# EasyEDA schematic SCH_HomeAuto_2022-10-05.json
TITLE: Home Automation; REV: 1.0; Date: 2022-10-02; Sheet: 1/1; Drawn By: Gopal Naik; Company: Ajju Creation
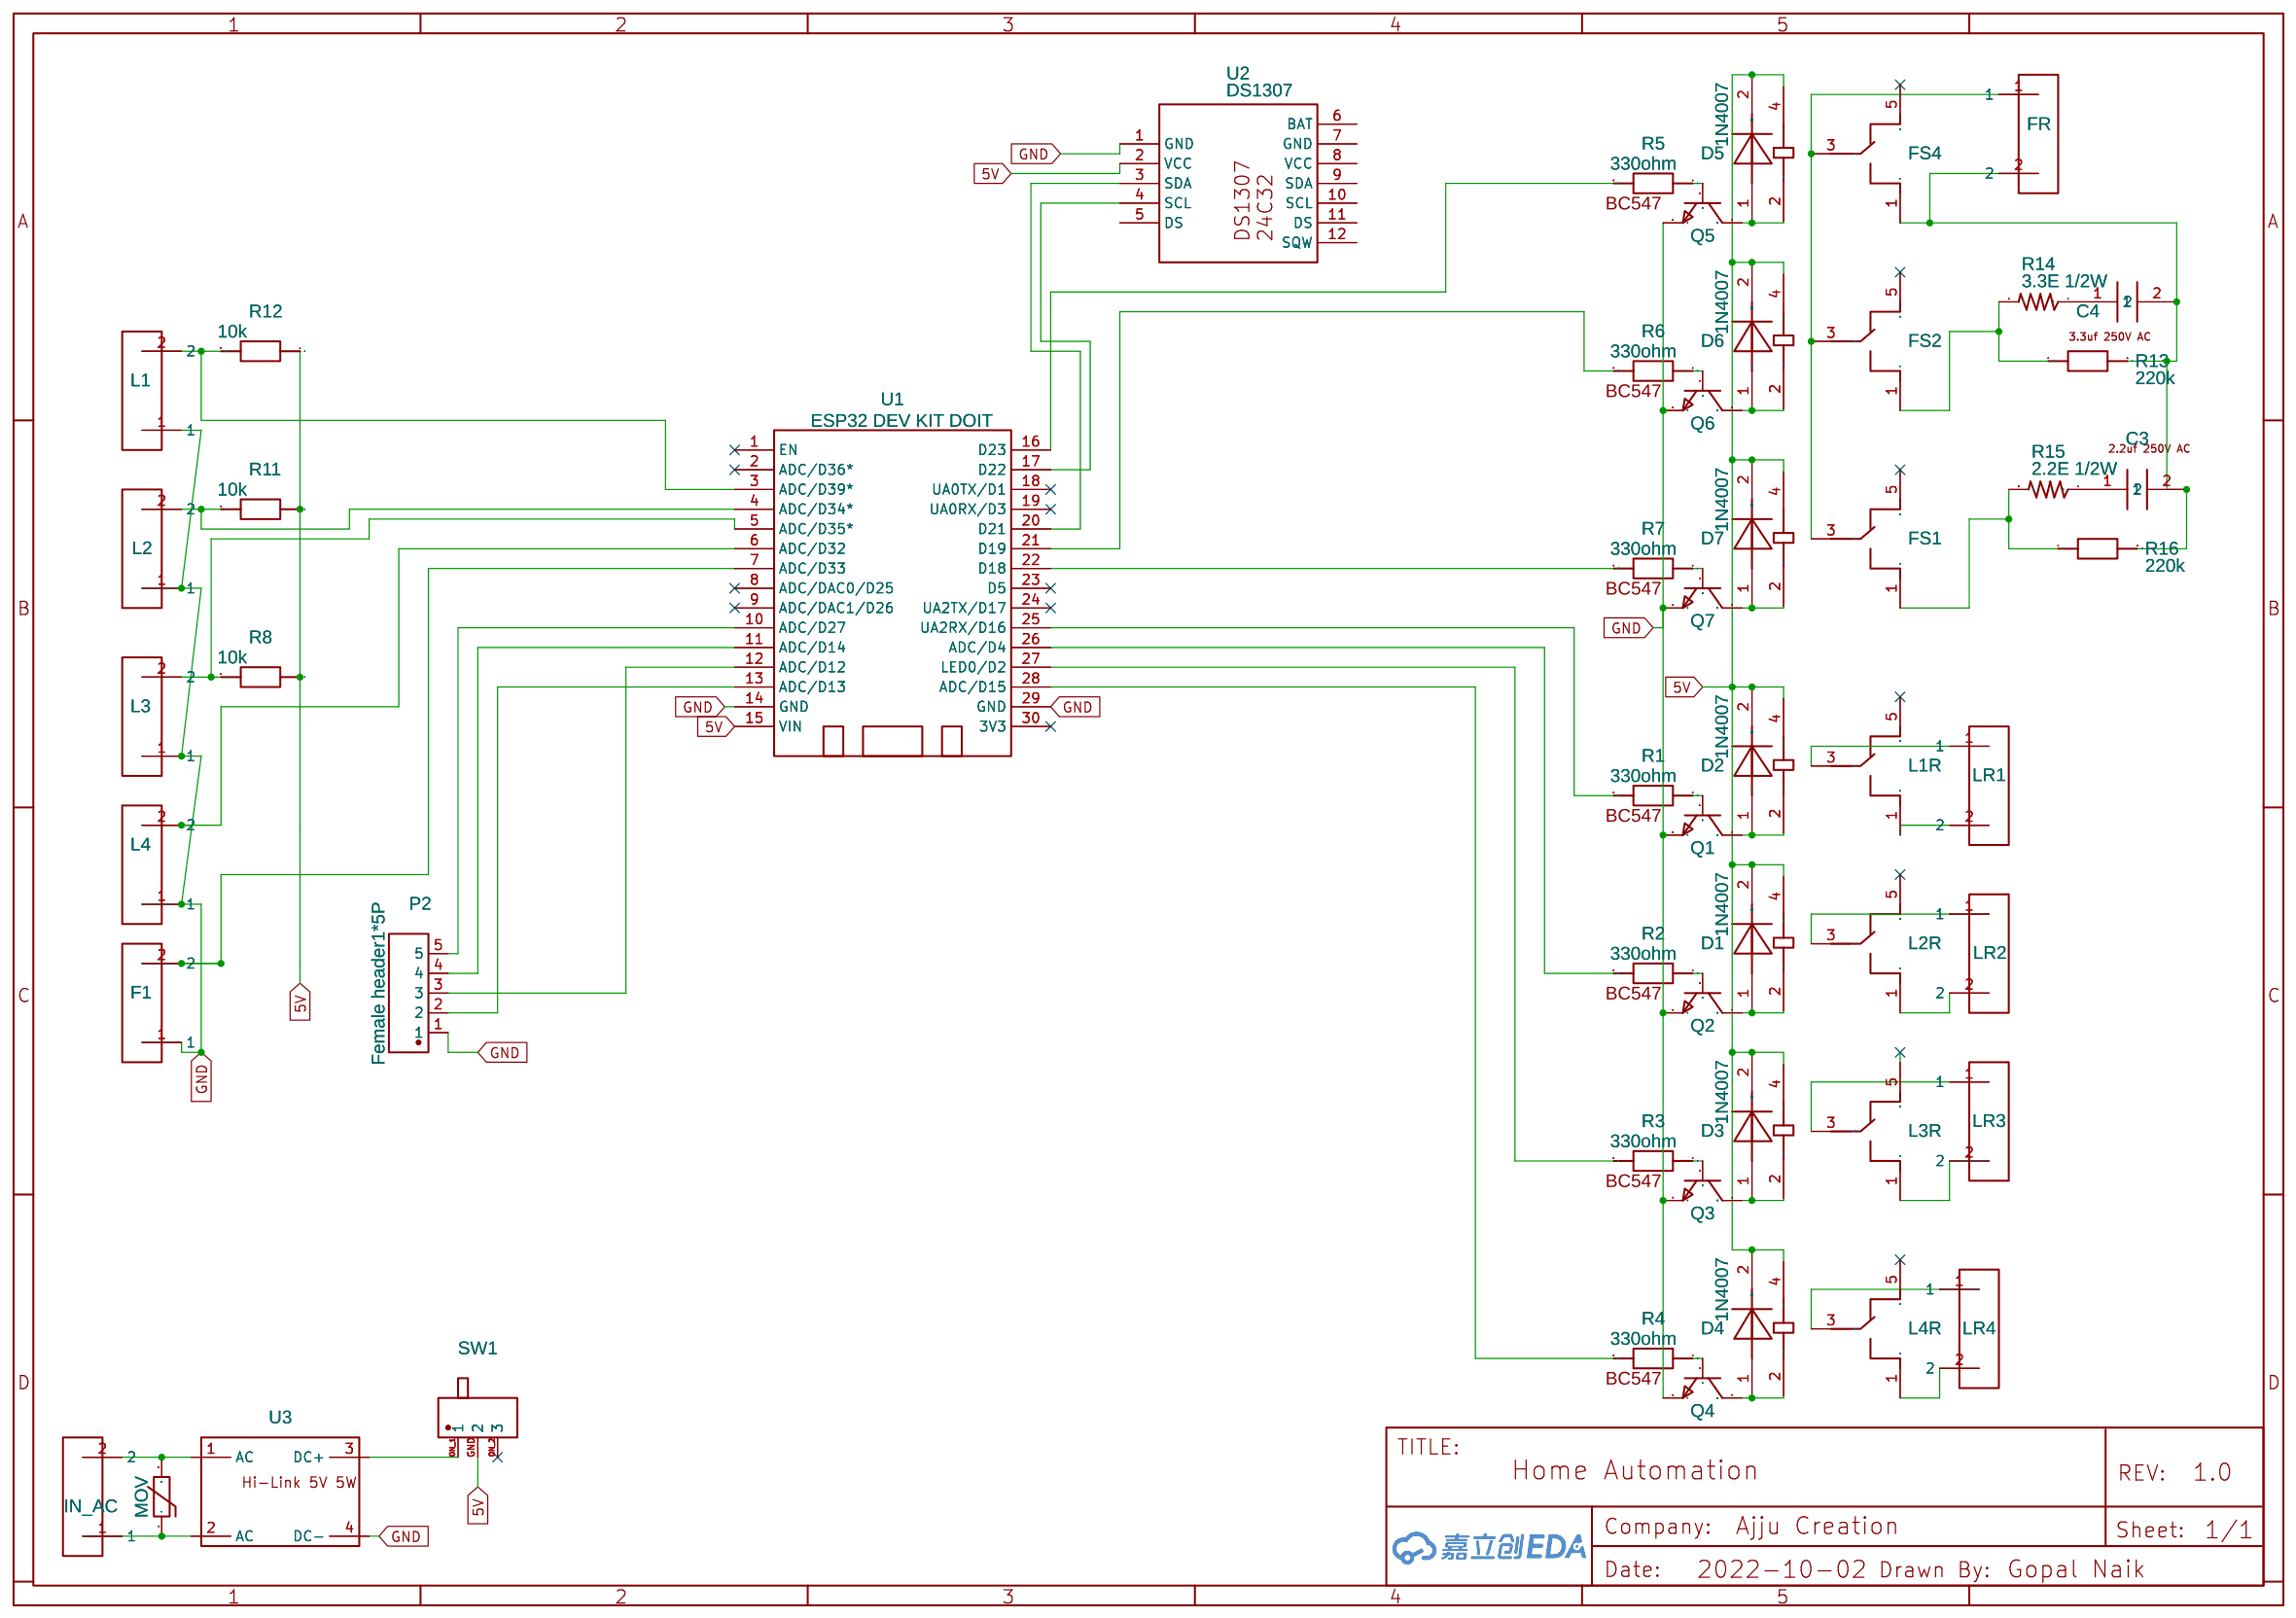
[diagram p0: schematic sheet]

## Parts
C3  New_Symbol 2.2 uf 250v ac  [2.2UF 250V AC CAPACITOR]
C4  New_Symbol 2.2 uf 250v ac  [2.2UF 250V AC CAPACITOR]
D1  1N4007  [DIODE_IN4007]
D2  1N4007  [DIODE_IN4007]
D3  1N4007  [DIODE_IN4007]
D4  1N4007  [DIODE_IN4007]
D5  1N4007  [DIODE_IN4007]
D6  1N4007  [DIODE_IN4007]
D7  1N4007  [DIODE_IN4007]
F1  2 Pin Plug-In Screw Terminal Block 5.08mm pitch  [2 PIN PLUG-IN SCREW TERMINAL BLOCK 5.08MM PITCH]
FR  2 Pin Plug-In Screw Terminal Block 5.08mm pitch  [2 PIN PLUG-IN SCREW TERMINAL BLOCK 5.08MM PITCH]
FS1  RELAY-SPST  [RELAY-TH_RELAY-SPST]
FS2  RELAY-SPST  [RELAY-TH_RELAY-SPST]
FS4  RELAY-SPST  [RELAY-TH_RELAY-SPST]
IN_AC  2 Pin Plug-In Screw Terminal Block 5.08mm pitch  [2 PIN PLUG-IN SCREW TERMINAL BLOCK 5.08MM PITCH]
L1  2 Pin Plug-In Screw Terminal Block 5.08mm pitch  [2 PIN PLUG-IN SCREW TERMINAL BLOCK 5.08MM PITCH]
L1R  RELAY-SPST  [RELAY-TH_RELAY-SPST]
L2  2 Pin Plug-In Screw Terminal Block 5.08mm pitch  [2 PIN PLUG-IN SCREW TERMINAL BLOCK 5.08MM PITCH]
L2R  RELAY-SPST  [RELAY-TH_RELAY-SPST]
L3  2 Pin Plug-In Screw Terminal Block 5.08mm pitch  [2 PIN PLUG-IN SCREW TERMINAL BLOCK 5.08MM PITCH]
L3R  RELAY-SPST  [RELAY-TH_RELAY-SPST]
L4  2 Pin Plug-In Screw Terminal Block 5.08mm pitch  [2 PIN PLUG-IN SCREW TERMINAL BLOCK 5.08MM PITCH]
L4R  RELAY-SPST  [RELAY-TH_RELAY-SPST]
LR1  2 Pin Plug-In Screw Terminal Block 5.08mm pitch  [2 PIN PLUG-IN SCREW TERMINAL BLOCK 5.08MM PITCH]
LR2  2 Pin Plug-In Screw Terminal Block 5.08mm pitch  [2 PIN PLUG-IN SCREW TERMINAL BLOCK 5.08MM PITCH]
LR3  2 Pin Plug-In Screw Terminal Block 5.08mm pitch  [2 PIN PLUG-IN SCREW TERMINAL BLOCK 5.08MM PITCH]
LR4  2 Pin Plug-In Screw Terminal Block 5.08mm pitch  [2 PIN PLUG-IN SCREW TERMINAL BLOCK 5.08MM PITCH]
P2  Female header1*5P  [HDR-TH_5P-P2.00-V-F-1]
Q1  BC547  [BC547]
Q2  BC547  [BC547]
Q3  BC547  [BC547]
Q4  BC547  [BC547]
Q5  BC547  [BC547]
Q6  BC547  [BC547]
Q7  BC547  [BC547]
R1  330ohm  [330 OHM 0.25W 11MM EXT]
R2  330ohm  [330 OHM 0.25W 11MM EXT]
R3  330ohm  [330 OHM 0.25W 11MM EXT]
R4  330ohm  [330 OHM 0.25W 11MM EXT]
R5  330ohm  [330 OHM 0.25W 11MM EXT]
R6  330ohm  [330 OHM 0.25W 11MM EXT]
R7  330ohm  [330 OHM 0.25W 11MM EXT]
R8  10k  [330 OHM 0.25W 11MM EXT]
R11  10k  [330 OHM 0.25W 11MM EXT]
R12  10k  [330 OHM 0.25W 11MM EXT]
R13  220k  [330 OHM 0.25W 11MM EXT]
R14  3.3E 1/2W  [2.2E RESISTANCE 1/2W]
R15  2.2E 1/2W  [2.2E RESISTANCE 1/2W]
R16  220k  [330 OHM 0.25W 11MM EXT]
SW1  3-Pin SPDT Slide Switch  [3-PIN SPDT SLIDE SWITCH_]
U1  ESP32 DEV KIT DOIT  [DOIT-ESP32-DEVKIT-V1]
U2  DS1307  [DS1307/24C32]
U3  HLK-5M05 Hi-Link 5V 5W  [HLK-5M05 HI-LINK 5V 5W]
VAR1  MOV  [MOV-14D781K]

## Library data of the parts
C3 C4 = New_Symbol 2.2 uf 250v ac: Contributor: pks.tec
D1-D7 = 1N4007: Manufacturer Part: DIODE; Supplier Part: undefined; Contributor: mhk1367
F1 FR IN_AC L1-L4 LR1-LR4 = 2 Pin Plug-In Screw Terminal Block 5.08mm pitch: Supplier: Banggood; link: https://www.banggood.com/60pcs-2-Pin-Plug-In-Screw-Terminal-Block-Connector-5_08mm-Pitch-p-1185450.html?cur_warehouse=CN&rmmds=search; Contributor: Shaun.M
FS1 FS2 FS4 L1R L2R L3R L4R = RELAY-SPST: Supplier: LCSC; Supplier Part: C2941249; Manufacturer: null; Manufacturer Part: Relay-SPST; JLCPCB Part Class: Extended Part; Contributor: Agung Adiprasetya
P2 = Female header1*5P: Supplier: LCSC; Manufacturer: BOOMELE; Supplier Part: C66508; JLCPCB Part Class: Extended Part
Q1-Q7 = BC547: Contributor: gokulpriya
R1-R8 R11-R13 R16 = 330 OHM 0.25W 11MM: Contributor: roberto26
R14 R15 = 2.2E RESISTANCE 1/2W: Contributor: pritams07
SW1 = 3-Pin SPDT Slide Switch: Supplier: LCSC; Supplier Part: C496203; Manufacturer: Dailywell; Manufacturer Part: 5MS1S102BM1QES; Contributor: Dr. Diaz; link: https://www.jameco.com/z/SS-12E17-3-Pin-SPDT-Slide-Switch_2258831.html?CID=MERCH
U1 = ESP32 DEV KIT DOIT: Contributor: ConceitoTeam
U2 = DS1307: Supplier Part: undefined; Contributor: Danil Sekret
U3 = HLK-5M05 Hi-Link 5V 5W: Manufacturer: Hi-Link; Manufacturer Part: HLK-5M05; Supplier Part: Hi-Link AC-DC Module 5V 1A - 5W; Contributor: pco_design
VAR1 = VAR - MOV-14D781K: Manufacturer: Bourns; Supplier: Mouser; Supplier Part: 652-MOV-14D781K; link: https://eu.mouser.com/ProductDetail/Bourns/MOV-14D781K/?qs=CQ3B1E%252BbPs0ldslZeI3dBQ%3D%3D; Contributor: dude.hudin

## Nets
5V: D1.2(Diode IN4007) D2.2(Diode IN4007) D3.2(Diode IN4007) D4.2(Diode IN4007) D5.2(Diode IN4007) D6.2(Diode IN4007) D7.2(Diode IN4007) FS1.4 FS2.4 FS4.4 L1R.4 L2R.4 L3R.4 L4R.4 R8.1 R11.1 R12.1 SW1.GND(2) U1.15(VIN) U2.2(VCC)
GND: F1.1 L1.1 L2.1 L3.1 L4.1 P2.1 Q1.3(E) Q2.3(E) Q3.3(E) Q4.3(E) Q5.3(E) Q6.3(E) Q7.3(E) U1.14(GND) U1.29(GND) U2.1(GND) U3.4(DC-)
Net-(C3-1): C3.1 R15.1
Net-(C3-2): C3.2 C4.2 FR.2 FS4.1 R13.2 R16.2
Net-(C4-1): C4.1 R14.1
Net-(D1-1): D1.1 L2R.2 Q2.1(C)
Net-(D2-1): D2.1 L1R.2 Q1.1(C)
Net-(D3-1): D3.1 L3R.2 Q3.1(C)
Net-(D4-1): D4.1 L4R.2 Q4.1(C)
Net-(D5-1): D5.1 FS4.2 Q5.1(C)
Net-(D6-1): D6.1 FS2.2 Q6.1(C)
Net-(D7-1): D7.1 FS1.2 Q7.1(C)
Net-(F1-2): F1.2 U1.7(ADC/D33)
Net-(FR-1): FR.1 FS1.3 FS2.3 FS4.3
Net-(FS1-1): FS1.1 R15.2 R16.1
Net-(FS2-1): FS2.1 R13.1 R14.2
Net-(IN_AC-1): IN_AC.1 U3.2(AC) VAR1.1
Net-(IN_AC-2): IN_AC.2 U3.1(AC) VAR1.2
Net-(L1-2): L1.2 R12.2 U1.3(ADC/D39*)
Net-(L1R-1): L1R.1 LR1.2
Net-(L1R-3): L1R.3 LR1.1
Net-(L2-2): L2.2 R11.2 U1.4(ADC/D34*)
Net-(L2R-1): L2R.1 LR2.2
Net-(L2R-3): L2R.3 LR2.1
Net-(L3-2): L3.2 R8.2 U1.5(ADC/D35*)
Net-(L3R-1): L3R.1 LR3.2
Net-(L3R-3): L3R.3 LR3.1
Net-(L4-2): L4.2 U1.6(ADC/D32)
Net-(L4R-1): L4R.1 LR4.2
Net-(L4R-3): L4R.3 LR4.1
Net-(P2-2): P2.2 U1.13(ADC/D13)
Net-(P2-3): P2.3 U1.12(ADC/D12)
Net-(P2-4): P2.4 U1.11(ADC/D14)
Net-(P2-5): P2.5 U1.10(ADC/D27)
Net-(Q1-2): Q1.2(B) R1.1
Net-(Q2-2): Q2.2(B) R2.1
Net-(Q3-2): Q3.2(B) R3.1
Net-(Q4-2): Q4.2(B) R4.1
Net-(Q5-2): Q5.2(B) R5.1
Net-(Q6-2): Q6.2(B) R6.1
Net-(Q7-2): Q7.2(B) R7.1
Net-(R1-2): R1.2 U1.25(UA2RX/D16)
Net-(R2-2): R2.2 U1.26(ADC/D4)
Net-(R3-2): R3.2 U1.27(LED0/D2)
Net-(R4-2): R4.2 U1.28(ADC/D15)
Net-(R5-2): R5.2 U1.16(D23)
Net-(R6-2): R6.2 U1.21(D19)
Net-(R7-2): R7.2 U1.22(D18)
Net-(SW1-ON_1): SW1.ON_1(1) U3.3(DC+)
Net-(U1-17): U1.17(D22) U2.4(SCL)
Net-(U1-20): U1.20(D21) U2.3(SDA)

Not connected (* = marked no-connect by the designer): FS1 5*; FS2 5*; FS4 5*; L1R 5*; L2R 5*; L3R 5; L4R 5*; SW1 ON_2(3)*; U1 1(EN)* 2(ADC/D36*)* 8(ADC/DAC0/D25)* 9(ADC/DAC1/D26)* 18(UA0TX/D1)* 19(UA0RX/D3)* 23(D5)* 24(UA2TX/D17)* 30(3V3)*; U2 5(DS) 6(BAT) 7(GND) 8(VCC) 9(SDA) 10(SCL) 11(DS) 12(SQW)
